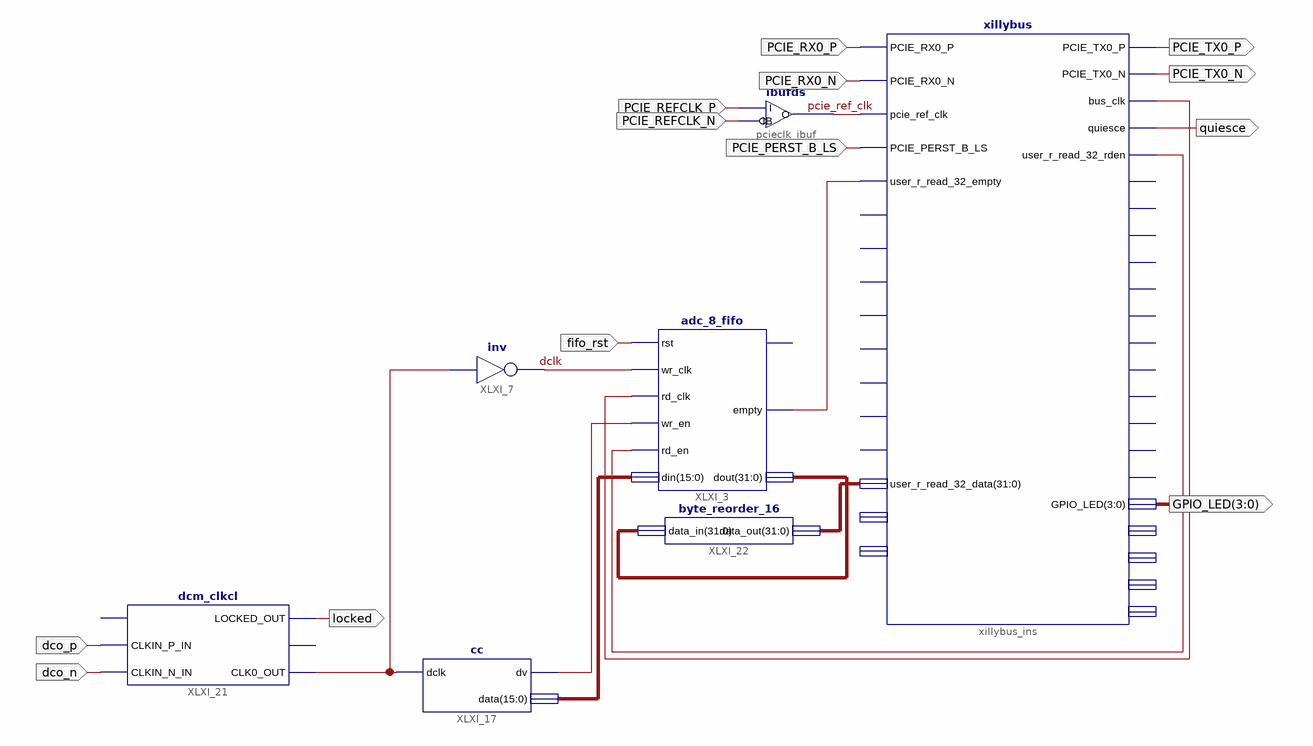
[diagram p0: schematic sheet 1]
// Xilinx ISE schematic brd_clk_chk.sch (virtex5) as structural Verilog: 7 symbols, 13 ports
module brd_clk_chk (
  input  fifo_rst,
  input  PCIE_RX0_P,
  input  PCIE_RX0_N,
  input  PCIE_PERST_B_LS,
  input  PCIE_REFCLK_P,
  input  PCIE_REFCLK_N,
  input  dco_p,
  input  dco_n,
  output PCIE_TX0_P,
  output PCIE_TX0_N,
  output quiesce,
  output [3:0] GPIO_LED,
  output locked
);

  wire dclk, pcie_ref_clk, XLXN_8, XLXN_10, XLXN_12, XLXN_70, XLXN_78;
  wire [15:0] XLXN_82;
  wire [31:0] XLXN_72, XLXN_73;

  adc_8_fifo XLXI_3 (
    .rst(fifo_rst), .wr_clk(dclk), .rd_clk(XLXN_10), .wr_en(XLXN_70), .rd_en(XLXN_12), .din(XLXN_82),
    .empty(XLXN_8), .dout(XLXN_72));  // open: full
  xillybus xillybus_ins (
    .PCIE_RX0_P(PCIE_RX0_P), .PCIE_RX0_N(PCIE_RX0_N), .pcie_ref_clk(pcie_ref_clk),
    .PCIE_PERST_B_LS(PCIE_PERST_B_LS), .user_r_read_32_empty(XLXN_8), .user_r_read_32_data(XLXN_73),
    .PCIE_TX0_P(PCIE_TX0_P), .PCIE_TX0_N(PCIE_TX0_N), .bus_clk(XLXN_10), .quiesce(quiesce),
    .user_r_read_32_rden(XLXN_12), .GPIO_LED(GPIO_LED));  // open: user_r_read_32_eof, user_w_write_32_full, user_r_read_8_empty, user_r_read_8_eof, user_w_write_8_full, user_r_mem_8_empty, user_r_mem_8_eof, user_w_mem_8_full, user_r_read_8_data, user_r_mem_8_data, user_r_read_32_open, user_w_write_32_wren, user_w_write_32_open, user_r_read_8_rden, user_r_read_8_open, user_w_write_8_wren, user_w_write_8_open, user_r_mem_8_rden, user_r_mem_8_open, user_w_mem_8_wren, user_w_mem_8_open, user_mem_8_addr_update, user_w_write_32_data, user_w_write_8_data, user_w_mem_8_data, user_mem_8_addr
  ibufds pcieclk_ibuf (.I(PCIE_REFCLK_P), .IB(PCIE_REFCLK_N), .O(pcie_ref_clk));
  not XLXI_7 (dclk, XLXN_78);
  cc XLXI_17 (.dclk(XLXN_78), .dv(XLXN_70), .data(XLXN_82));
  dcm_clkcl XLXI_21 (
    .CLKIN_P_IN(dco_p), .CLKIN_N_IN(dco_n), .LOCKED_OUT(locked), .CLK0_OUT(XLXN_78));  // open: RST_IN, CLKIN_IBUFGDS_OUT
  byte_reorder_16 XLXI_22 (.data_in(XLXN_72), .data_out(XLXN_73));
endmodule
